# Altium schematic sheet Power.SchDoc
size A4; SheetNumber: 10; SheetTotal: 12
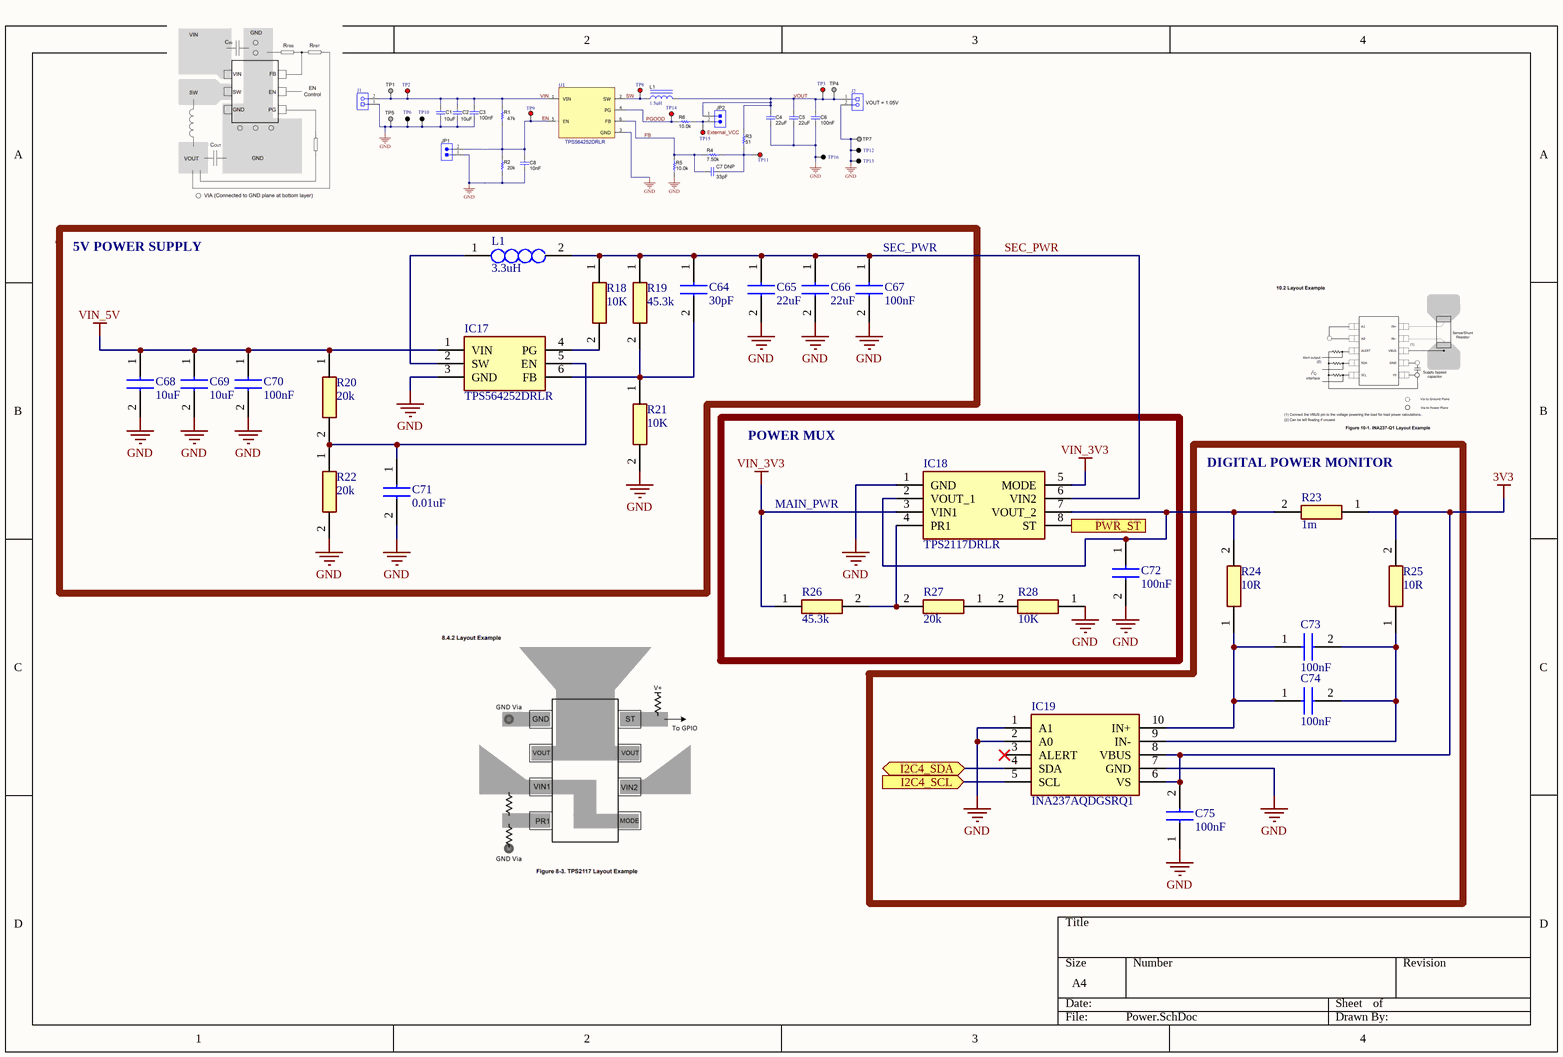
[diagram p0: Power.SchDoc]

## Parts
C64  30pF  [C0603]
C65  22uF  [CAPC1608X90N]
C66  22uF  [CAPC1608X90N]
C67  100nF  [CAPC1608X95N]
C68  10uF  [CAPC1608X90N]
C69  10uF  [CAPC1608X90N]
C70  100nF  [CAPC1608X95N]
C71  0.01uF  [C0603]
C72  100nF  [CAPC1608X95N]
C73  100nF  [CAPC1608X95N]
C74  100nF  [CAPC1608X95N]
C75  100nF  [CAPC1608X95N]
IC17  TPS564252DRLR  [SOTFL50P160X60-6N]
IC18  TPS2117DRLR  [SOTFL50P160X60-8N]
IC19  INA237AQDGSRQ1  [SOP50P490X110-10N]
L1  3.3uH  [INDPM5653X430N]
R18  10K  [RESC1508X50N]
R19  45.3k  [RESC1608X55N]
R20  20k  [RESC1608X55N]
R21  10K  [RESC1508X50N]
R22  20k  [RESC1608X55N]
R23  1m  [RESC2012X80N]
R24  10R  [RESC1608X55N]
R25  10R  [RESC1608X55N]
R26  45.3k  [RESC1608X55N]
R27  20k  [RESC1608X55N]
R28  10K  [RESC1508X50N]

## Blocks framed on the sheet
5V POWER SUPPLY: C64-C71 IC17 L1 R18-R22
POWER MUX: C72 IC18 R26-R28
DIGITAL POWER MONITOR: C73-C75 IC19 R23-R25

## Ports
I2C4_SCL (in), I2C4_SDA (bidir), PWR_ST (out)

## Nets
3V3: C75.2 IC19.6(VS) IC19.8(VBUS) R23.1 R25.2
GND: C65.2 C66.2 C67.2 C68.2 C69.2 C70.2 C71.2 C72.2 C75.1 IC17.3(GND) IC18.1(GND) IC19.1(A1) IC19.2(A0) IC19.7(GND) R21.2 R22.2 R28.1
VIN_3V3: IC18.3(VIN1) IC18.5(MODE) R26.1
VIN_5V: C68.1 C69.1 C70.1 IC17.1(VIN) R20.1
I2C4_SCL: IC19.5(SCL) ; port I2C4_SCL
I2C4_SDA: IC19.4(SDA) ; port I2C4_SDA
PWR_ST: IC18.8(ST) ; port PWR_ST
SEC_PWR: C64.1 C65.1 C66.1 C67.1 IC18.6(VIN2) L1.2 R18.1 R19.1
NetC64_2: C64.2 IC17.6(FB) R19.2 R21.1
NetC71_1: C71.1 IC17.5(EN) R20.2 R22.1
NetC72_1: C72.1 IC18.2(VOUT_1) IC18.7(VOUT_2) R23.2 R24.2
NetC73_1: C73.1 C74.1 IC19.10(IN+) R24.1
NetC73_2: C73.2 C74.2 IC19.9(IN-) R25.1
NetIC17_2: IC17.2(SW) L1.1
NetIC17_4: IC17.4(PG) R18.2
NetIC18_4: IC18.4(PR1) R26.2 R27.2
NetR27_1: R27.1 R28.2

Not connected (* = marked no-connect by the designer): IC19 3(ALERT)*

## Notes on the sheet
- (near C67) SEC_PWR
- MAIN_PWR

## Library data of the parts
C64 = C0603C300F5HACAUTO: 30 pF ±1% 50V Ceramic Capacitor X8R 0603 (1608 Metric); Manufacturer_Name: KEMET; Datasheet Link: https://content.kemet.com/datasheets/KEM_C1007_X8R_ULTRA_150C_SMD.pdf; Height: 0.87mm; Manufacturer_Part_Number: C0603C300F5HACAUTO; Mouser Part Number: 80-C0603C300F5HAUTO; Mouser Price/Stock: https://www.mouser.com/Search/Refine.aspx?Keyword=80-C0603C300F5HAUTO
C65 C66 = GRT188R61A226ME13D: 22 µF ±20% 10V Ceramic Capacitor X5R 0603 (1608 Metric); Manufacturer_Name: Murata Electronics; Datasheet Link: https://psearch.en.murata.com/capacitor/product/GRT188R61A226ME13%23.html; Height: 0.9mm; Manufacturer_Part_Number: GRT188R61A226ME13D; Mouser Part Number: 81-GRT188R61A226ME13; Mouser Price/Stock: https://www.mouser.co.uk/ProductDetail/Murata-Electronics/GRT188R61A226ME13D?qs=rrS6PyfT74d5NiMXLiYh8Q%3D%3D; Arrow Part Number: GRT188R61A226ME13D; Arrow Price/Stock: https://www.arrow.com/en/products/grt188r61a226me13d/murata-manufacturing?region=nac
C67 C70 C72-C75 = C0603C104M4RAC7867: 0.1 µF ±20% 16V Ceramic Capacitor X7R 0603 (1608 Metric); Manufacturer_Name: KEMET; Datasheet Link: https://www.arrow.com/en/products/c0603c104m4rac7867/kemet-corporation?region=nac; Height: 0.95mm; Manufacturer_Part_Number: C0603C104M4RAC7867; Mouser Part Number: N/A; Mouser Price/Stock: https://www.mouser.co.uk/ProductDetail/KEMET/C0603C104M4RAC7867?qs=nAEW9fCjKd%252BI998RVtZhZQ%3D%3D; Arrow Part Number: C0603C104M4RAC7867; Arrow Price/Stock: https://www.arrow.com/en/products/c0603c104m4rac7867/kemet-corporation?region=europe
C68 C69 = GRM188D71A106KA73D: CAP CER 10UF 10V X7T 0603; Manufacturer_Name: Murata Electronics; Datasheet Link: https://psearch.en.murata.com/capacitor/product/GRM188D71A106KA73%23.html; Height: 0.9mm; Manufacturer_Part_Number: GRM188D71A106KA73D; Mouser Part Number: 81-GRM188D71A106KA3D; Mouser Price/Stock: https://www.mouser.co.uk/ProductDetail/Murata-Electronics/GRM188D71A106KA73D?qs=FvQ4nYu%252B2He2GIhYKxXmMQ%3D%3D; Arrow Part Number: GRM188D71A106KA73D; Arrow Price/Stock: https://www.arrow.com/en/products/grm188d71a106ka73d/murata-manufacturing?region=nac
C71 = C0603C103KMRECAUTO: 10000 pF ±10% 63V Ceramic Capacitor X7R 0603 (1608 Metric); Manufacturer_Name: KEMET; Datasheet Link: https://content.kemet.com/datasheets/KEM_C1090_X7R_ESD.pdf; Height: 0.87mm; Manufacturer_Part_Number: C0603C103KMRECAUTO; Mouser Part Number: 80-C0603C103KMREAUTO; Mouser Price/Stock: https://www.mouser.co.uk/ProductDetail/KEMET/C0603C103KMRECAUTO?qs=u4fy%2FsgLU9P0r6p3bzZgfw%3D%3D; Arrow Part Number: C0603C103KMRECAUTO; Arrow Price/Stock: https://www.arrow.com/en/products/c0603c103kmrecauto/kemet-corporation?region=nac
IC17 = TPS564257DRLR: TPS564252DRLR / Buck Switching Regulator IC Positive Adjustable 0.6V 1 Output 4A SOT-563, SOT-666; Manufacturer_Name: Texas Instruments; Datasheet Link: https://www.ti.com/lit/ds/symlink/tps564257.pdf?HQS=dis-mous-null-mousermode-dsf-pf-null-wwe&ts=1695023870951&ref_url=https%253A%252F%252Fwww.mouser.de%252F; Height: 0.6mm; Manufacturer_Part_Number: TPS564257DRLR; Mouser Part Number: 595-TPS564257DRLR; Mouser Price/Stock: https://www.mouser.co.uk/ProductDetail/Texas-Instruments/TPS564257DRLR?qs=ulEaXIWI0c8amaZvnJWTQQ%3D%3D
IC18 = TPS2116DRLR: Power Switch/Driver 1:1 N-Channel 4A SOT-583; Manufacturer_Name: Texas Instruments; Datasheet Link: https://www.ti.com/lit/gpn/tps2116; Height: 0.6mm; Manufacturer_Part_Number: TPS2116DRLR; Mouser Part Number: 595-TPS2116DRLR; Mouser Price/Stock: https://www.mouser.co.uk/ProductDetail/Texas-Instruments/TPS2116DRLR?qs=aP1CjGhiNiGo3XAyXcVPaQ%3D%3D; Arrow Part Number: TPS2116DRLR; Arrow Price/Stock: https://www.arrow.com/en/products/tps2116drlr/texas-instruments?region=nac
IC19 = INA237AQDGSRQ1: Power Supply Controller 10-VSSOP; Manufacturer_Name: Texas Instruments; Datasheet Link: https://www.ti.com/lit/ds/symlink/ina237-q1.pdf?ts=1625619121802; Height: 1.1mm; Manufacturer_Part_Number: INA237AQDGSRQ1; Mouser Part Number: 595-INA237AQDGSRQ1; Mouser Price/Stock: https://www.mouser.co.uk/ProductDetail/Texas-Instruments/INA237AQDGSRQ1?qs=QNEnbhJQKvZMdvZTHxOefQ%3D%3D; Arrow Part Number: INA237AQDGSRQ1; Arrow Price/Stock: https://www.arrow.com/en/products/ina237aqdgsrq1/texas-instruments?region=nac
L1 = 744316330: 3.3 µH Shielded Wirewound Inductor 5.75 A 18.5mOhm 2-SMD; Manufacturer_Name: Wurth Elektronik; Datasheet Link: https://componentsearchengine.com/Datasheets/1/744316330.pdf; Height: 4.3mm; Manufacturer_Part_Number: 744316330; Mouser Part Number: 710-744316330; Mouser Price/Stock: https://www.mouser.co.uk/ProductDetail/Wurth-Elektronik/744316330?qs=%252B7BPNfeNhvX5azP5TkUELg%3D%3D
R18 R21 R28 = RNCP0603FTD10K0: 10 kOhms ±1% 0.125W, 1/8W Chip Resistor 0603 (1608 Metric) Anti-Sulfur Thin Film; Manufacturer_Name: Stackpole Electronics; Datasheet Link: https://cs.seielect.com/catalog/SEI-RNCP.pdf; Height: 0.5mm; Manufacturer_Part_Number: RNCP0603FTD10K0; Mouser Part Number: 708-RNCP0603FTD10K0; Mouser Price/Stock: https://www.mouser.co.uk/ProductDetail/SEI-Stackpole/RNCP0603FTD10K0?qs=FESYatJ8odL1jmHQSpKOPg%3D%3D; Arrow Part Number: RNCP0603FTD10K0; Arrow Price/Stock: https://www.arrow.com/en/products/rncp0603ftd10k0/stackpole-electronics?region=nac
R19 R26 = RMCF0603FT45K3: 45.3 kOhms ±1% 0.1W, 1/10W Chip Resistor 0603 (1608 Metric) Automotive AEC-Q200 Thick Film; Manufacturer_Name: Stackpole Electronics; Datasheet Link: https://www.seielect.com/Catalog/SEI-RMCF_RMCP.pdf; Height: 0.55mm; Manufacturer_Part_Number: RMCF0603FT45K3; Arrow Part Number: RMCF0603FT45K3; Arrow Price/Stock: https://www.arrow.com/en/products/rmcf0603ft45k3/stackpole-electronics
R20 R22 R27 = ERJ-3EKF2002V: 20 kOhms ±1% 0.1W, 1/10W Chip Resistor 0603 (1608 Metric) Automotive AEC-Q200 Thick Film; Manufacturer_Name: Panasonic; Datasheet Link: http://industrial.panasonic.com/cdbs/www-data/pdf/RDA0000/AOA0000C86.pdf; Height: 0.55mm; Manufacturer_Part_Number: ERJ-3EKF2002V; Mouser Part Number: 667-ERJ-3EKF2002V; Mouser Price/Stock: https://www.mouser.co.uk/ProductDetail/Panasonic/ERJ-3EKF2002V?qs=66DK8nO8gJB3y0uxig0mNg%3D%3D; Arrow Part Number: ERJ-3EKF2002V; Arrow Price/Stock: https://www.arrow.com/en/products/erj-3ekf2002v/panasonic?region=europe
R23 = CRF0805-FZ-R001ELF: 1 mOhms ±1% 0.5W, 1/2W Chip Resistor 0805 (2012 Metric) Automotive AEC-Q200, Current Sense, Moisture Resistant Metal Element; Manufacturer_Name: Bourns; Datasheet Link: https://www.bourns.com/docs/product-datasheets/CRF.pdf; Height: 0.8mm; Manufacturer_Part_Number: CRF0805-FZ-R001ELF; Mouser Part Number: 652-CRF0805FZR001ELF; Mouser Price/Stock: https://www.mouser.co.uk/ProductDetail/Bourns/CRF0805-FZ-R001ELF?qs=t7xnP681wgV0AIQaUselMQ%3D%3D; Arrow Part Number: CRF0805-FZ-R001ELF; Arrow Price/Stock: https://www.arrow.com/en/products/crf0805-fz-r001elf/bourns?region=nac
R24 R25 = ERJ-3EKF10R0V: 10 Ohms ±1% 0.1W, 1/10W Chip Resistor 0603 (1608 Metric) Automotive AEC-Q200 Thick Film; Manufacturer_Name: Panasonic; Datasheet Link: http://industrial.panasonic.com/cdbs/www-data/pdf/RDA0000/AOA0000C86.pdf; Height: 0.55mm; Manufacturer_Part_Number: ERJ-3EKF10R0V; Mouser Part Number: 667-ERJ-3EKF10R0V; Mouser Price/Stock: https://www.mouser.co.uk/ProductDetail/Panasonic/ERJ-3EKF10R0V?qs=Y94Hbc6uvEMT73hhx3Gvwg%3D%3D; Arrow Part Number: ERJ-3EKF10R0V; Arrow Price/Stock: https://www.arrow.com/en/products/erj-3ekf10r0v/panasonic?region=nac